# EAGLE design QuadWing 2x2 (EAGLE 9.3.2)
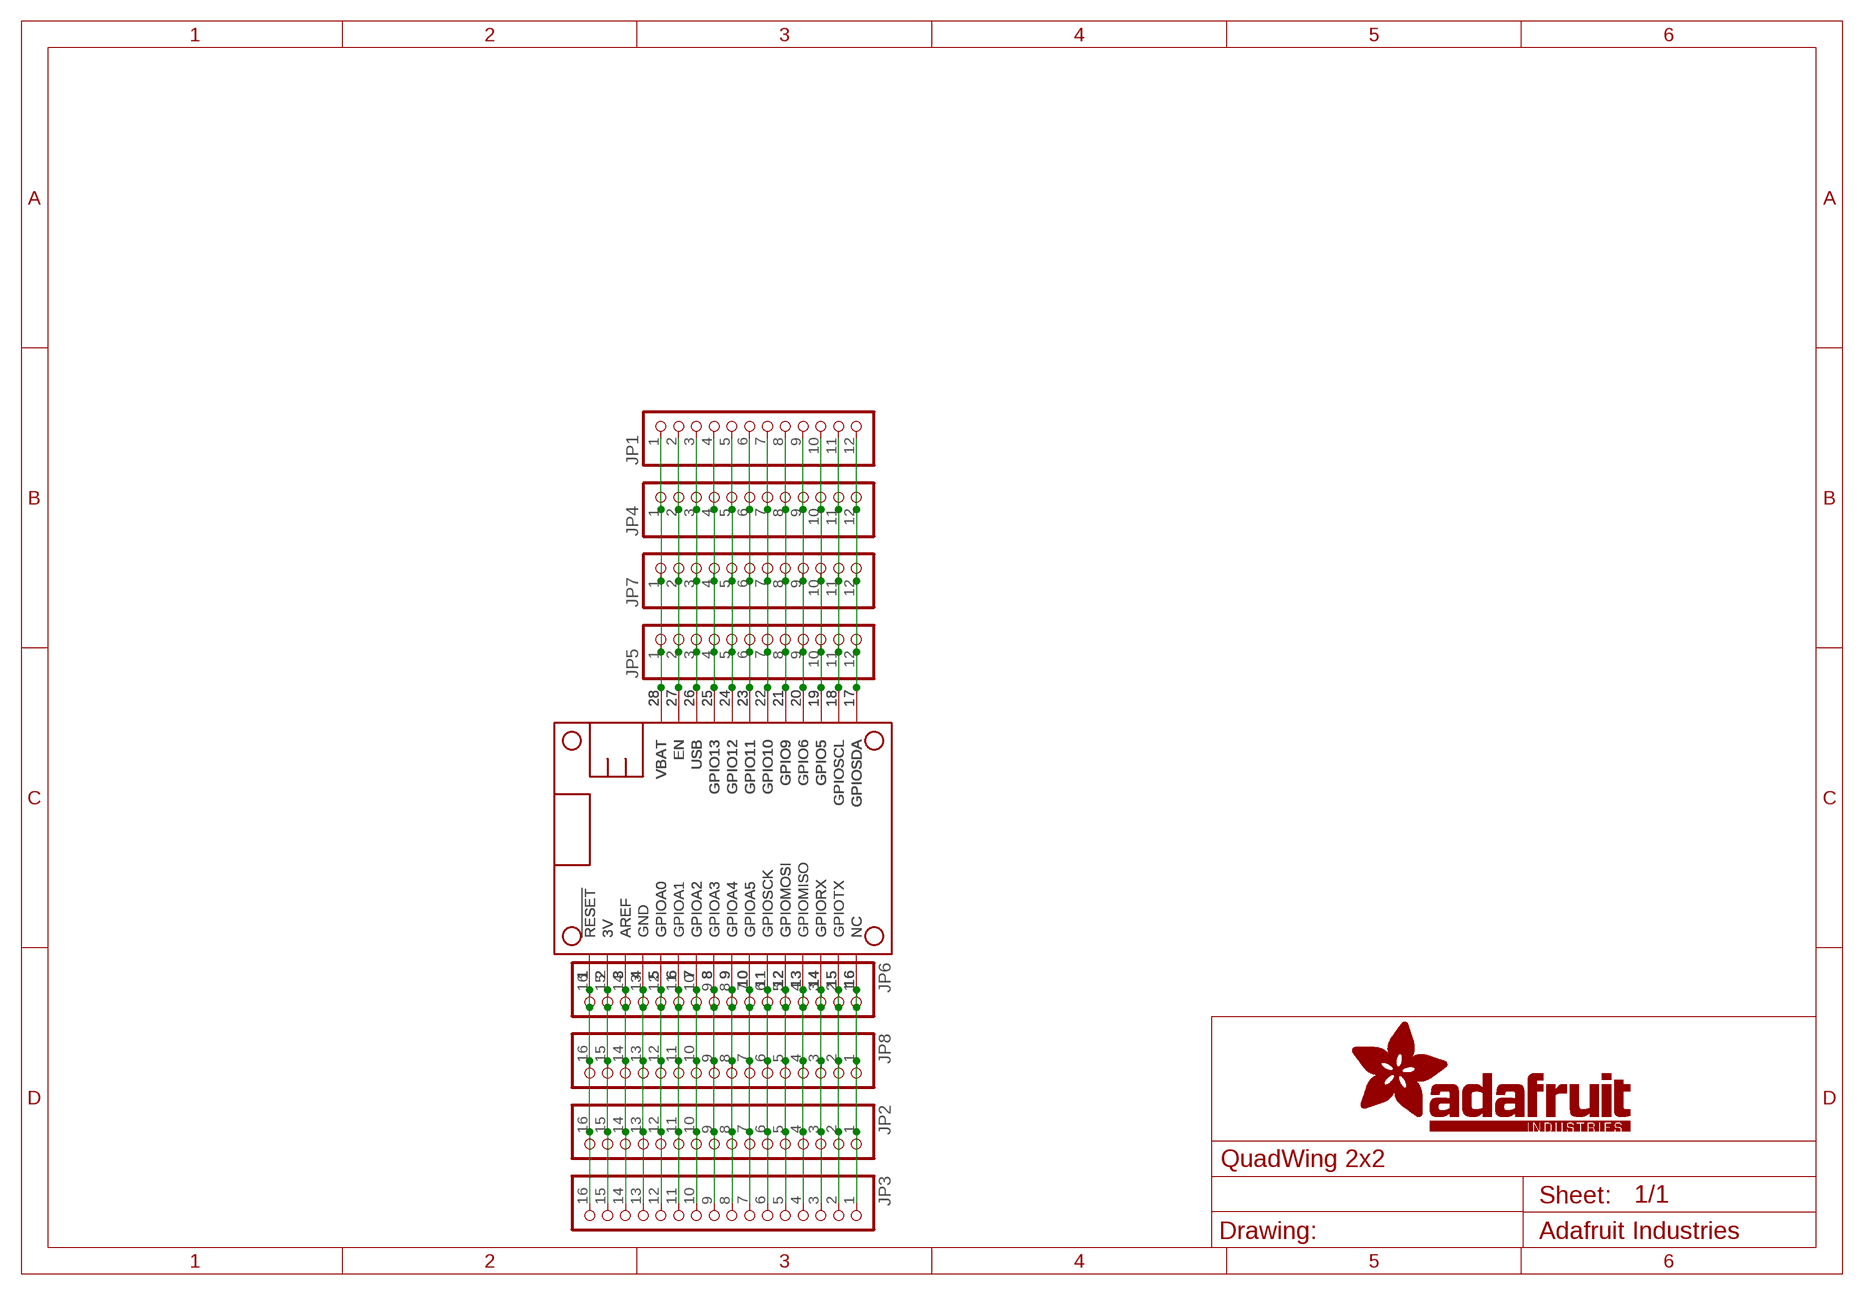
[diagram p0: schematic, sheet 1]

## Parts
JP1  HEADER-1X1276MIL  [1X12_ROUND_76MIL]
JP2  HEADER-1X16_76MIL  [1X16_ROUND_76MIL]
JP3  HEADER-1X16_76MIL  [1X16_ROUND_76MIL]
JP4  HEADER-1X1276MIL  [1X12_ROUND_76MIL]
JP5  HEADER-1X1276MIL  [1X12_ROUND_76MIL]
JP6  HEADER-1X16_76MIL  [1X16_ROUND_76MIL]
JP7  HEADER-1X1276MIL  [1X12_ROUND_76MIL]
JP8  HEADER-1X16_76MIL  [1X16_ROUND_76MIL]
MS1  FEATHERWING_NODIM  [FEATHERWING_DIM]
MS2  FEATHERWING_NODIM  [FEATHERWING_DIM]
MS3  FEATHERWING_NODIM  [FEATHERWING_DIM]
MS4  FEATHERWING_NODIM  [FEATHERWING_DIM]

## Nets
3V: JP2.15 JP3.15 JP6.15 JP8.15 MS1.2(3V) MS2.2(3V) MS3.2(3V) MS4.2(3V)
A: JP2.12 JP3.12 JP6.12 JP8.12 MS1.5(GPIOA0) MS2.5(GPIOA0) MS3.5(GPIOA0) MS4.5(GPIOA0)
AREF: JP2.14 JP3.14 JP6.14 JP8.14 MS1.3(AREF) MS2.3(AREF) MS3.3(AREF) MS4.3(AREF)
B: JP2.11 JP3.11 JP6.11 JP8.11 MS1.6(GPIOA1) MS2.6(GPIOA1) MS3.6(GPIOA1) MS4.6(GPIOA1)
C: JP2.10 JP3.10 JP6.10 JP8.10 MS1.7(GPIOA2) MS2.7(GPIOA2) MS3.7(GPIOA2) MS4.7(GPIOA2)
D: JP2.9 JP3.9 JP6.9 JP8.9 MS1.8(GPIOA3) MS2.8(GPIOA3) MS3.8(GPIOA3) MS4.8(GPIOA3)
E: JP2.8 JP3.8 JP6.8 JP8.8 MS1.9(GPIOA4) MS2.9(GPIOA4) MS3.9(GPIOA4) MS4.9(GPIOA4)
EN: JP1.2 JP4.2 JP5.2 JP7.2 MS1.27(EN) MS2.27(EN) MS3.27(EN) MS4.27(EN)
F: JP2.7 JP3.7 JP6.7 JP8.7 MS1.10(GPIOA5) MS2.10(GPIOA5) MS3.10(GPIOA5) MS4.10(GPIOA5)
G: JP2.1 JP3.1 JP6.1 JP8.1 MS1.16(NC) MS2.16(NC) MS3.16(NC) MS4.16(NC)
GND: JP2.13 JP3.13 JP6.13 JP8.13 MS1.4(GND) MS2.4(GND) MS3.4(GND) MS4.4(GND)
I: JP1.9 JP4.9 JP5.9 JP7.9 MS1.20(GPIO6) MS2.20(GPIO6) MS3.20(GPIO6) MS4.20(GPIO6)
J: JP1.10 JP4.10 JP5.10 JP7.10 MS1.19(GPIO5) MS2.19(GPIO5) MS3.19(GPIO5) MS4.19(GPIO5)
K: JP1.8 JP4.8 JP5.8 JP7.8 MS1.21(GPIO9) MS2.21(GPIO9) MS3.21(GPIO9) MS4.21(GPIO9)
L: JP1.7 JP4.7 JP5.7 JP7.7 MS1.22(GPIO10) MS2.22(GPIO10) MS3.22(GPIO10) MS4.22(GPIO10)
M: JP1.6 JP4.6 JP5.6 JP7.6 MS1.23(GPIO11) MS2.23(GPIO11) MS3.23(GPIO11) MS4.23(GPIO11)
MISO: JP2.4 JP3.4 JP6.4 JP8.4 MS1.13(GPIOMISO) MS2.13(GPIOMISO) MS3.13(GPIOMISO) MS4.13(GPIOMISO)
MOSI: JP2.5 JP3.5 JP6.5 JP8.5 MS1.12(GPIOMOSI) MS2.12(GPIOMOSI) MS3.12(GPIOMOSI) MS4.12(GPIOMOSI)
N: JP1.5 JP4.5 JP5.5 JP7.5 MS1.24(GPIO12) MS2.24(GPIO12) MS3.24(GPIO12) MS4.24(GPIO12)
O: JP1.4 JP4.4 JP5.4 JP7.4 MS1.25(GPIO13) MS2.25(GPIO13) MS3.25(GPIO13) MS4.25(GPIO13)
RESET: JP2.16 JP3.16 JP6.16 JP8.16 MS1.1(!RESET) MS2.1(!RESET) MS3.1(!RESET) MS4.1(!RESET)
RX: JP2.3 JP3.3 JP6.3 JP8.3 MS1.14(GPIORX) MS2.14(GPIORX) MS3.14(GPIORX) MS4.14(GPIORX)
SCK: JP2.6 JP3.6 JP6.6 JP8.6 MS1.11(GPIOSCK) MS2.11(GPIOSCK) MS3.11(GPIOSCK) MS4.11(GPIOSCK)
SCL: JP1.11 JP4.11 JP5.11 JP7.11 MS1.18(GPIOSCL) MS2.18(GPIOSCL) MS3.18(GPIOSCL) MS4.18(GPIOSCL)
SDA: JP1.12 JP4.12 JP5.12 JP7.12 MS1.17(GPIOSDA) MS2.17(GPIOSDA) MS3.17(GPIOSDA) MS4.17(GPIOSDA)
TX: JP2.2 JP3.2 JP6.2 JP8.2 MS1.15(GPIOTX) MS2.15(GPIOTX) MS3.15(GPIOTX) MS4.15(GPIOTX)
USB: JP1.3 JP4.3 JP5.3 JP7.3 MS1.26(USB) MS2.26(USB) MS3.26(USB) MS4.26(USB)
VBAT: JP1.1 JP4.1 JP5.1 JP7.1 MS1.28(VBAT) MS2.28(VBAT) MS3.28(VBAT) MS4.28(VBAT)

## Library data of the parts
JP1 JP4 JP5 JP7 = microbuilder:HEADER-1X12
JP2 JP3 JP6 JP8 = microbuilder:HEADER-1X16: PIN HEADER
MS1-MS4 = microbuilder:FEATHERWING

## Board
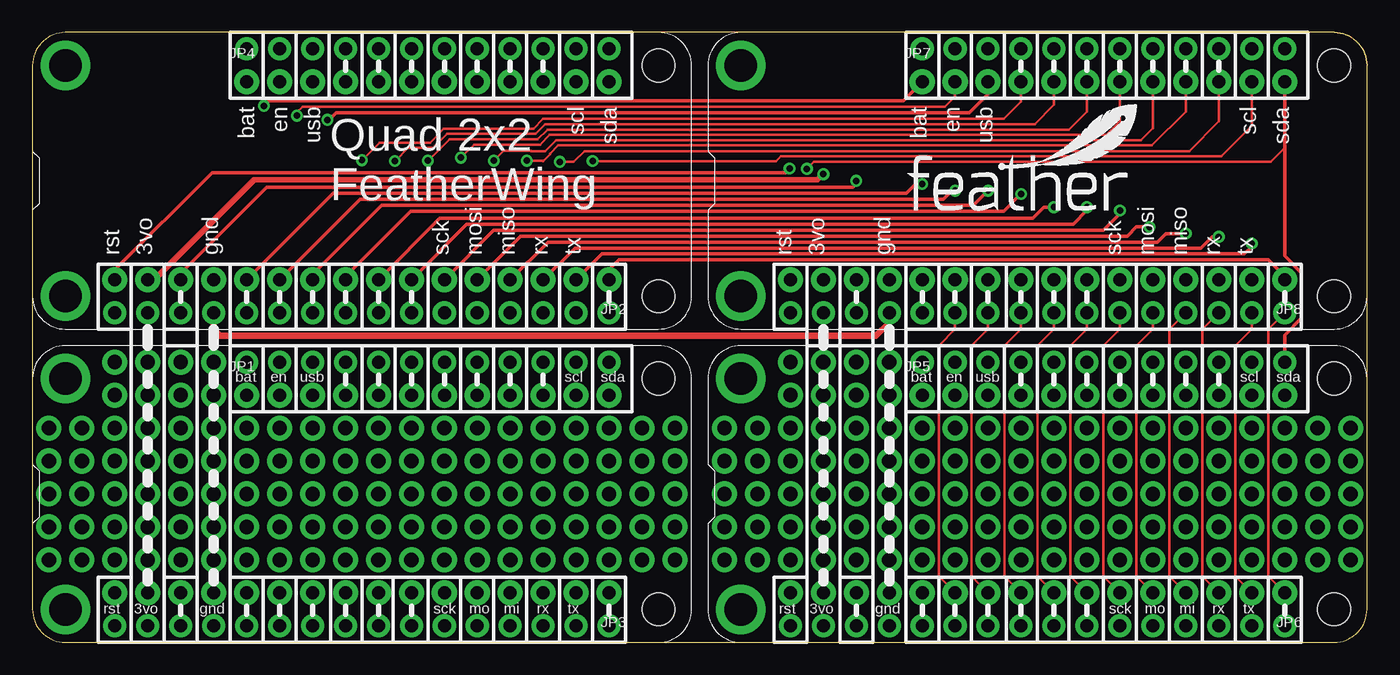
[diagram p1: board, top side]
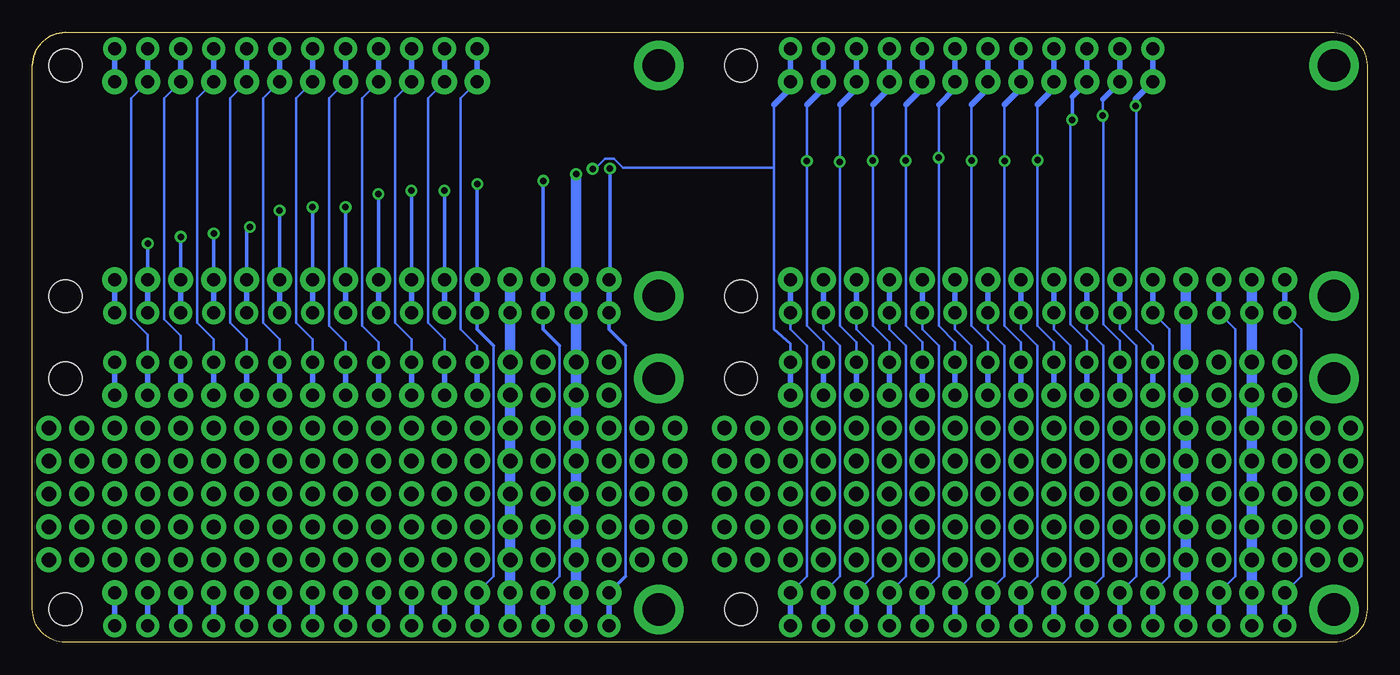
[diagram p2: board, bottom side, seen from below]

Size 102.87 x 46.99 mm. Coordinates in mm from the lower left corner, seen from the top.
Outline: 100.33,46.99 arc-90 102.87,44.45
Outline: 102.87,44.45 102.87,2.54 arc-90 100.33,0 2.54,0 arc-90 0,2.54 0,44.45 arc-90 2.54,46.99 100.33,46.99
Outline: 102.87,44.45 arc90 100.33,46.99
Copper layers (1*16): Top 0.035mm / dielectric 1.5mm / Bottom 0.035mm
Design rules "adafruit": minimum track width 8mil, minimum drill 15.5mil, track to track 8mil, track to pad 8mil, pad to pad 8mil, via to via 8mil, smd to smd 8mil, copper to edge 10mil, drill to drill 8mil, minimum pad ring 10mil, minimum via ring 8mil, stop-mask expansion 2mil, vias tented up to drill 20mil, thermal gap 10mil

### Footprints (pad centres in the part's own frame; a part is rotated, then mirrored left to right if it is on the bottom)
1X12_ROUND_76MIL = drill 1 pad 1.93: 1 -13.97,0; 2 -11.43,0; 3 -8.89,0; 4 -6.35,0; 5 -3.81,0; 6 -1.27,0; 7 1.27,0; 8 3.81,0; 9 6.35,0; 10 8.89,0; 11 11.43,0; 12 13.97,0
1X16_ROUND_76MIL = drill 1 pad 1.93: 1 -19.05,0; 2 -16.51,0; 3 -13.97,0; 4 -11.43,0; 5 -8.89,0; 6 -6.35,0; 7 -3.81,0; 8 -1.27,0; 9 1.27,0; 10 3.81,0; 11 6.35,0; 12 8.89,0; 13 11.43,0; 14 13.97,0; 15 16.51,0; 16 19.05,0
FEATHERWING_DIM = drill 1 pad 1.778: 1 6.35,1.27; 2 8.89,1.27; 3 11.43,1.27; 4 13.97,1.27; 5 16.51,1.27; 6 19.05,1.27; 7 21.59,1.27; 8 24.13,1.27; 9 26.67,1.27; 10 29.21,1.27; 11 31.75,1.27; 12 34.29,1.27; 13 36.83,1.27; 14 39.37,1.27; 15 41.91,1.27; 16 44.45,1.27; 17 44.45,21.59; 18 41.91,21.59; 19 39.37,21.59; 20 36.83,21.59; 21 34.29,21.59; 22 31.75,21.59; 23 29.21,21.59; 24 26.67,21.59; 25 24.13,21.59; 26 21.59,21.59; 27 19.05,21.59; 28 16.51,21.59 | drill 2.5 pad 3.81: P$1 2.54,20.32; P$2 2.54,2.54 | hole 2.54: 48.26,20.32; 48.26,2.54

### Placement (x,y rotation side)
JP1  30.48,19.05 0 top
JP2  25.4,27.94 180 top
JP3  25.4,3.81 180 top
JP4  30.48,43.18 0 top
JP5  82.55,19.05 0 top
JP6  77.47,3.81 180 top
JP7  82.55,43.18 0 top
JP8  77.47,27.94 180 top
MS1  0,0 0 top
MS2  0,24.13 0 top
MS3  52.07,0 0 top
MS4  52.07,24.13 0 top
U$2  [FEATHERLOGO_MED]  67.31,33.21 0 top

### Tracks (layer width: path | path; a pad name or v marks a point on that pad's centre or on a via)
3V  (via drill 0.5, 1.1 pad 1.93)
  Top 0.406: JP2.15 9.4,27.94 17.08,35.62 60.52,35.62 v60.96,36.07
  Bottom 0.813: MS1.2 JP3.15 v8.89,6.35 v8.89,8.89 v8.89,11.43 v8.89,13.97 v8.89,16.51 v8.89,19.05 v8.89,21.59 MS2.2 JP2.15 | MS3.2 JP6.15 v60.96,6.35 v60.96,8.89 v60.96,11.43 v60.96,13.97 v60.96,16.51 v60.96,19.05 v60.96,21.59 MS4.2 JP8.15 v60.96,36.07
A  (via drill 0.5)
  Top 0.254: JP2.12 23.16,34.59 67.36,34.59 68.07,35.31 v68.58,35.31
  Bottom 0.203: JP3.12 15.24,5.08 15.24,24.13 MS2.5 | 67.31,22.86 67.31,5.08 JP6.12
  Bottom 0.254: 67.31,22.86 68.58,24.13 MS4.5 | v68.58,35.31 JP8.12
  Bottom 0.406: JP3.12 MS1.5 | JP2.12 MS2.5 | JP6.12 MS3.5 | JP8.12 MS4.5
AREF  (via drill 0.5)
  Top 0.254: JP2.14 11.43,28.45 18.03,35.05 63.25,35.05 63.5,35.31 v63.5,35.56
  Bottom 0.203: JP3.14 10.16,5.08 10.16,24.13 MS2.3 | 62.23,22.86 62.23,5.08 JP6.14
  Bottom 0.254: 62.23,22.86 63.5,24.13 MS4.3 | v63.5,35.56 JP8.14
  Bottom 0.406: JP3.14 MS1.3 | JP2.14 MS2.3 | JP6.14 MS3.3 | JP8.14 MS4.3
B  (via drill 0.5)
  Top 0.203: MS4.6 71.12,24.13 69.85,22.86 69.85,5.08 JP6.11
  Top 0.254: JP2.11 25.25,34.14 70.21,34.14 70.87,34.8 v71.12,34.8 | JP2.11
  Bottom 0.203: JP3.11 17.78,5.08 17.78,22.86 19.05,24.13 MS2.6
  Bottom 0.254: v71.12,34.8 JP8.11
  Bottom 0.406: MS1.6 JP3.11 | JP2.11 MS2.6 | JP6.11 MS3.6 | JP8.11 MS4.6
C  (via drill 0.5)
  Top 0.203: MS4.7 73.66,24.13 72.39,22.86 72.39,5.08 JP6.10
  Top 0.254: JP2.10 21.59,28.35 26.92,33.68 72.54,33.68 v73.66,34.8
  Bottom 0.203: JP3.10 20.32,5.08 20.32,22.86 21.59,24.13 MS2.7
  Bottom 0.254: v73.66,34.8 JP8.10
  Bottom 0.406: JP3.10 MS1.7 | JP2.10 MS2.7 | JP6.10 MS3.7 | JP8.10 MS4.7
D  (via drill 0.5)
  Top 0.203: MS4.8 76.2,24.13 74.93,22.86 74.93,5.08 JP6.9
  Top 0.254: JP2.9 24.13,28.19 29.16,33.22 74.88,33.22 v76.2,34.54
  Bottom 0.203: JP3.9 22.86,5.08 22.86,22.86 24.13,24.13 MS2.8
  Bottom 0.254: v76.2,34.54 JP8.9
  Bottom 0.406: MS1.8 JP3.9 | JP2.9 MS2.8 | JP6.9 MS3.8 | JP8.9 MS4.8
E  (via drill 0.5)
  Top 0.203: MS4.9 78.74,24.13 77.47,22.86 77.47,5.08 JP6.8
  Top 0.254: JP2.8 31.39,32.66 77.1,32.66 77.96,33.53 v78.74,33.53
  Bottom 0.203: JP3.8 25.4,5.08 25.4,22.86 26.67,24.13 MS2.9
  Bottom 0.254: v78.74,33.53 JP8.8
  Bottom 0.406: JP3.8 MS1.9 | JP2.8 MS2.9 | JP6.8 MS3.9 | JP8.8 MS4.9
EN  (via drill 0.5)
  Top 0.203: JP7.2 71.12,42.04 70.34,41.26 20.82,41.26 20.38,40.83 v20.38,40.58
  Bottom 0.203: MS1.27 19.05,23.24 20.32,24.51 20.32,40.51 v20.38,40.58 20.38,41.85 | MS3.27 71.12,23.37 72.39,24.64 72.39,41.91 JP7.2
  Bottom 0.406: JP1.2 MS1.27 | MS2.27 JP4.2 20.38,41.85 | MS3.27 JP5.2 | MS4.27 JP7.2
F  (via drill 0.5)
  Top 0.203: MS4.10 81.28,24.13 80.01,22.86 80.01,5.08 JP6.7
  Top 0.254: v81.28,33.53 81.28,33.27 80.21,32.21 33.48,32.21 JP2.7
  Bottom 0.203: JP3.7 27.94,5.08 27.94,22.86 29.21,24.13 MS2.10
  Bottom 0.254: v81.28,33.53 JP8.7
  Bottom 0.406: MS1.10 JP3.7 | JP2.7 MS2.10 | JP6.7 MS3.10 | JP8.7 MS4.10
G
  Top 0.203: MS4.16 95.25,24.13 95.25,5.08 JP6.1
  Top 0.254: JP2.1 44.45,28.7 45.21,29.46 95.25,29.46 96.52,28.19 JP8.1
  Bottom 0.203: JP3.1 43.18,5.08 43.18,22.86 44.45,24.13 MS2.16
  Bottom 0.406: JP3.1 MS1.16 | JP2.1 MS2.16 | JP6.1 MS3.16 | JP8.1 MS4.16
GND  (via drill 1.1 pad 1.93)
  Top 0.508: MS2.4 13.97,24.13 14.48,23.62 65.02,23.62 66.04,24.64 MS4.4
  Bottom 0.813: MS1.4 JP3.13 v13.97,6.35 v13.97,8.89 v13.97,11.43 v13.97,13.97 v13.97,16.51 v13.97,19.05 v13.97,21.59 MS2.4 JP2.13 | MS3.4 JP6.13 v66.04,6.35 v66.04,8.89 v66.04,11.43 v66.04,13.97 v66.04,16.51 v66.04,19.05 v66.04,21.59 MS4.4 JP8.13
I  (via drill 0.5)
  Top 0.203: JP7.9 88.9,40.89 86.3,38.29 40.52,38.29 39.88,37.65 39.88,37.6 39.37,37.08 39.35,37.1 v38.1,37.1
  Bottom 0.203: MS1.20 36.83,23.11 38.1,24.38 v38.1,37.1 38.1,41.4 | MS3.20 88.9,23.37 90.17,24.64 90.17,41.91 JP7.9
  Bottom 0.406: MS1.20 JP1.9 | MS2.20 JP4.9 36.83,42.67 38.1,41.4 | MS3.20 JP5.9 | MS4.20 JP7.9
J  (via drill 0.5)
  Top 0.203: v40.64,37.02 41.72,37.02 42.55,37.85 89.16,37.85 91.44,40.13 JP7.10
  Bottom 0.203: 39.37,21.08 MS1.19 39.37,23.11 40.64,24.38 v40.64,37.02 40.64,41.4 | MS3.19 91.44,23.62 92.71,24.89 92.71,41.91 JP7.10
  Bottom 0.406: JP1.10 39.37,21.08 | MS2.19 JP4.10 39.37,42.67 40.64,41.4 | MS3.19 JP5.10 | MS4.19 JP7.10
K  (via drill 0.5)
  Top 0.203: JP7.8 86.36,39.62 85.43,38.7 40.35,38.7 39.5,37.85 38.43,37.85 38.41,37.86 36.32,37.86 v35.56,37.1
  Bottom 0.203: MS1.21 34.29,23.11 35.56,24.38 v35.56,37.1 35.56,41.4 | MS3.21 86.36,23.37 87.63,24.64 87.63,41.91 JP7.8
  Bottom 0.406: JP1.8 MS1.21 | MS2.21 JP4.8 34.29,42.67 35.56,41.4 | MS3.21 JP5.8 | MS4.21 JP7.8
L  (via drill 0.5)
  Top 0.203: JP7.7 83.82,40.13 82.79,39.1 39.87,39.1 39.12,38.35 34.04,38.35 v33.02,37.34
  Bottom 0.203: MS1.22 31.75,23.11 33.02,24.38 v33.02,37.34 33.02,41.4 | MS3.22 83.82,23.37 85.09,24.64 85.09,41.91 JP7.7
  Bottom 0.406: MS1.22 JP1.7 | MS2.22 JP4.7 31.75,42.67 33.02,41.4 | MS3.22 JP5.7 | MS4.22 JP7.7
M  (via drill 0.5)
  Top 0.203: JP7.6 81.28,40.89 79.9,39.51 39.7,39.51 38.95,38.76 32.13,38.76 v30.48,37.1
  Bottom 0.203: MS1.23 29.21,23.11 30.48,24.38 v30.48,37.1 30.48,41.4 | MS3.23 81.28,23.37 82.55,24.64 82.55,41.91 JP7.6
  Bottom 0.406: JP1.6 MS1.23 | MS2.23 JP4.6 29.21,42.67 30.48,41.4 | MS3.23 JP5.6 | MS4.23 JP7.6
MISO  (via drill 0.5)
  Top 0.203: MS4.13 87.63,24.13 87.63,5.08 JP6.4
  Top 0.254: JP2.4 39.73,30.84 86.72,30.84 87.38,31.5 v88.9,31.5
  Bottom 0.203: JP3.4 35.56,5.08 35.56,22.86 36.83,24.13 MS2.13
  Bottom 0.254: v88.9,31.5 JP8.4
  Bottom 0.406: JP3.4 MS1.13 | JP2.4 MS2.13 | JP6.4 MS3.13 | JP8.4 MS4.13
MOSI  (via drill 0.5)
  Top 0.203: MS4.12 86.36,24.13 85.09,22.86 85.09,5.08 JP6.5
  Top 0.254: v86.11,32 85.09,32 84.38,31.29 37.64,31.29 JP2.5
  Bottom 0.203: JP3.5 33.02,5.08 33.02,22.86 34.29,24.13 MS2.12
  Bottom 0.254: v86.11,32 86.36,31.75 JP8.5
  Bottom 0.406: MS1.12 JP3.5 | JP2.5 MS2.12 | JP6.5 MS3.12 | JP8.5 MS4.12
N  (via drill 0.5)
  Top 0.203: JP7.5 78.74,41.4 77.25,39.92 39.53,39.92 38.78,39.17 31.97,39.17 30.9,38.1 28.96,38.1 v27.94,37.08
  Bottom 0.203: MS1.24 26.67,23.11 27.94,24.38 v27.94,37.08 27.94,41.4 | MS3.24 78.74,23.11 80.01,24.38 80.01,41.91 JP7.5
  Bottom 0.406: MS1.24 JP1.5 | MS2.24 JP4.5 26.67,42.67 27.94,41.4 | MS3.24 JP5.5 | MS4.24 JP7.5
N$1  (via drill 1.1 pad 1.93)
  other vias: 96.52,6.35
N$2  (via drill 1.1 pad 1.93)
  other vias: 96.52,8.89
N$3  (via drill 1.1 pad 1.93)
  other vias: 96.52,11.43
N$4  (via drill 1.1 pad 1.93)
  other vias: 96.52,13.97
N$5  (via drill 1.1 pad 1.93)
  other vias: 96.52,16.51
N$6  (via drill 1.1 pad 1.93)
  other vias: 93.98,16.51
N$7  (via drill 1.1 pad 1.93)
  other vias: 93.98,13.97
N$8  (via drill 1.1 pad 1.93)
  other vias: 93.98,11.43
N$9  (via drill 1.1 pad 1.93)
  other vias: 93.98,8.89
N$10  (via drill 1.1 pad 1.93)
  other vias: 93.98,6.35
N$11  (via drill 1.1 pad 1.93)
  other vias: 99.06,6.35
N$12  (via drill 1.1 pad 1.93)
  other vias: 99.06,8.89
N$13  (via drill 1.1 pad 1.93)
  other vias: 99.06,11.43
N$14  (via drill 1.1 pad 1.93)
  other vias: 99.06,13.97
N$15  (via drill 1.1 pad 1.93)
  other vias: 99.06,16.51
N$17  (via drill 1.1 pad 1.93)
  other vias: 101.6,16.51
N$18  (via drill 1.1 pad 1.93)
  other vias: 101.6,13.97
N$19  (via drill 1.1 pad 1.93)
  other vias: 101.6,11.43
N$20  (via drill 1.1 pad 1.93)
  other vias: 101.6,8.89
N$21  (via drill 1.1 pad 1.93)
  other vias: 101.6,6.35
N$22  (via drill 1.1 pad 1.93)
  other vias: 91.44,6.35
N$23  (via drill 1.1 pad 1.93)
  other vias: 91.44,8.89
N$24  (via drill 1.1 pad 1.93)
  other vias: 91.44,11.43
N$25  (via drill 1.1 pad 1.93)
  other vias: 91.44,13.97
N$26  (via drill 1.1 pad 1.93)
  other vias: 6.35,6.35
N$28  (via drill 1.1 pad 1.93)
  other vias: 11.43,6.35
N$31  (via drill 1.1 pad 1.93)
  other vias: 11.43,8.89
N$33  (via drill 1.1 pad 1.93)
  other vias: 6.35,8.89
N$34  (via drill 1.1 pad 1.93)
  other vias: 6.35,11.43
N$36  (via drill 1.1 pad 1.93)
  other vias: 3.81,6.35
N$37  (via drill 1.1 pad 1.93)
  other vias: 1.27,6.35
N$38  (via drill 1.1 pad 1.93)
  other vias: 1.27,8.89
N$39  (via drill 1.1 pad 1.93)
  other vias: 3.81,8.89
N$40  (via drill 1.1 pad 1.93)
  other vias: 3.81,11.43
N$41  (via drill 1.1 pad 1.93)
  other vias: 1.27,11.43
N$42  (via drill 1.1 pad 1.93)
  other vias: 1.27,13.97
N$43  (via drill 1.1 pad 1.93)
  other vias: 3.81,13.97
N$44  (via drill 1.1 pad 1.93)
  other vias: 6.35,13.97
N$46  (via drill 1.1 pad 1.93)
  other vias: 11.43,13.97
N$47  (via drill 1.1 pad 1.93)
  other vias: 11.43,11.43
N$50  (via drill 1.1 pad 1.93)
  other vias: 1.27,16.51
N$51  (via drill 1.1 pad 1.93)
  other vias: 3.81,16.51
N$52  (via drill 1.1 pad 1.93)
  other vias: 6.35,16.51
N$54  (via drill 1.1 pad 1.93)
  other vias: 11.43,16.51
N$58  (via drill 1.1 pad 1.93)
  other vias: 11.43,21.59
N$59  (via drill 1.1 pad 1.93)
  other vias: 11.43,19.05
N$62  (via drill 1.1 pad 1.93)
  other vias: 6.35,21.59
N$63  (via drill 1.1 pad 1.93)
  other vias: 6.35,19.05
N$64  (via drill 1.1 pad 1.93)
  other vias: 16.51,6.35
N$65  (via drill 1.1 pad 1.93)
  other vias: 16.51,8.89
N$66  (via drill 1.1 pad 1.93)
  other vias: 16.51,11.43
N$67  (via drill 1.1 pad 1.93)
  other vias: 16.51,13.97
N$68  (via drill 1.1 pad 1.93)
  other vias: 16.51,16.51
N$69  (via drill 1.1 pad 1.93)
  other vias: 19.05,16.51
N$70  (via drill 1.1 pad 1.93)
  other vias: 19.05,13.97
N$71  (via drill 1.1 pad 1.93)
  other vias: 19.05,11.43
N$72  (via drill 1.1 pad 1.93)
  other vias: 19.05,8.89
N$73  (via drill 1.1 pad 1.93)
  other vias: 19.05,6.35
N$74  (via drill 1.1 pad 1.93)
  other vias: 21.59,6.35
N$75  (via drill 1.1 pad 1.93)
  other vias: 21.59,8.89
N$76  (via drill 1.1 pad 1.93)
  other vias: 21.59,11.43
N$77  (via drill 1.1 pad 1.93)
  other vias: 21.59,13.97
N$78  (via drill 1.1 pad 1.93)
  other vias: 21.59,16.51
N$79  (via drill 1.1 pad 1.93)
  other vias: 24.13,16.51
N$80  (via drill 1.1 pad 1.93)
  other vias: 24.13,13.97
N$81  (via drill 1.1 pad 1.93)
  other vias: 24.13,11.43
N$82  (via drill 1.1 pad 1.93)
  other vias: 24.13,8.89
N$83  (via drill 1.1 pad 1.93)
  other vias: 24.13,6.35
N$84  (via drill 1.1 pad 1.93)
  other vias: 26.67,6.35
N$85  (via drill 1.1 pad 1.93)
  other vias: 26.67,8.89
N$86  (via drill 1.1 pad 1.93)
  other vias: 26.67,11.43
N$87  (via drill 1.1 pad 1.93)
  other vias: 26.67,13.97
N$88  (via drill 1.1 pad 1.93)
  other vias: 26.67,16.51
N$89  (via drill 1.1 pad 1.93)
  other vias: 29.21,16.51
N$90  (via drill 1.1 pad 1.93)
  other vias: 29.21,13.97
N$91  (via drill 1.1 pad 1.93)
  other vias: 29.21,11.43
N$92  (via drill 1.1 pad 1.93)
  other vias: 29.21,8.89
N$93  (via drill 1.1 pad 1.93)
  other vias: 29.21,6.35
N$94  (via drill 1.1 pad 1.93)
  other vias: 31.75,6.35
N$95  (via drill 1.1 pad 1.93)
  other vias: 34.29,6.35
N$96  (via drill 1.1 pad 1.93)
  other vias: 36.83,6.35
N$97  (via drill 1.1 pad 1.93)
  other vias: 39.37,6.35
N$98  (via drill 1.1 pad 1.93)
  other vias: 41.91,6.35
N$99  (via drill 1.1 pad 1.93)
  other vias: 41.91,8.89
N$100  (via drill 1.1 pad 1.93)
  other vias: 41.91,11.43
N$101  (via drill 1.1 pad 1.93)
  other vias: 41.91,13.97
N$102  (via drill 1.1 pad 1.93)
  other vias: 41.91,16.51
N$103  (via drill 1.1 pad 1.93)
  other vias: 39.37,16.51
N$104  (via drill 1.1 pad 1.93)
  other vias: 39.37,13.97
N$105  (via drill 1.1 pad 1.93)
  other vias: 39.37,11.43
N$106  (via drill 1.1 pad 1.93)
  other vias: 39.37,8.89
N$107  (via drill 1.1 pad 1.93)
  other vias: 36.83,8.89
N$108  (via drill 1.1 pad 1.93)
  other vias: 36.83,11.43
N$109  (via drill 1.1 pad 1.93)
  other vias: 36.83,13.97
N$110  (via drill 1.1 pad 1.93)
  other vias: 36.83,16.51
N$111  (via drill 1.1 pad 1.93)
  other vias: 34.29,16.51
N$112  (via drill 1.1 pad 1.93)
  other vias: 34.29,13.97
N$113  (via drill 1.1 pad 1.93)
  other vias: 34.29,11.43
N$114  (via drill 1.1 pad 1.93)
  other vias: 34.29,8.89
N$115  (via drill 1.1 pad 1.93)
  other vias: 31.75,8.89
N$116  (via drill 1.1 pad 1.93)
  other vias: 31.75,11.43
N$117  (via drill 1.1 pad 1.93)
  other vias: 31.75,13.97
N$118  (via drill 1.1 pad 1.93)
  other vias: 31.75,16.51
N$119  (via drill 1.1 pad 1.93)
  other vias: 44.45,16.51
N$120  (via drill 1.1 pad 1.93)
  other vias: 44.45,13.97
N$121  (via drill 1.1 pad 1.93)
  other vias: 44.45,11.43
N$122  (via drill 1.1 pad 1.93)
  other vias: 44.45,8.89
N$123  (via drill 1.1 pad 1.93)
  other vias: 44.45,6.35
N$124  (via drill 1.1 pad 1.93)
  other vias: 46.99,6.35
N$125  (via drill 1.1 pad 1.93)
  other vias: 49.53,6.35
N$126  (via drill 1.1 pad 1.93)
  other vias: 49.53,8.89
N$127  (via drill 1.1 pad 1.93)
  other vias: 46.99,8.89
N$128  (via drill 1.1 pad 1.93)
  other vias: 46.99,11.43
N$129  (via drill 1.1 pad 1.93)
  other vias: 49.53,11.43
N$130  (via drill 1.1 pad 1.93)
  other vias: 49.53,13.97
N$131  (via drill 1.1 pad 1.93)
  other vias: 46.99,13.97
N$132  (via drill 1.1 pad 1.93)
  other vias: 46.99,16.51
N$133  (via drill 1.1 pad 1.93)
  other vias: 49.53,16.51
N$213  (via drill 1.1 pad 1.93)
  other vias: 91.44,16.51
N$214  (via drill 1.1 pad 1.93)
  other vias: 88.9,16.51
N$215  (via drill 1.1 pad 1.93)
  other vias: 88.9,13.97
N$216  (via drill 1.1 pad 1.93)
  other vias: 88.9,11.43
N$217  (via drill 1.1 pad 1.93)
  other vias: 88.9,8.89
N$218  (via drill 1.1 pad 1.93)
  other vias: 88.9,6.35
N$219  (via drill 1.1 pad 1.93)
  other vias: 86.36,6.35
N$220  (via drill 1.1 pad 1.93)
  other vias: 86.36,8.89
N$221  (via drill 1.1 pad 1.93)
  other vias: 86.36,11.43
N$222  (via drill 1.1 pad 1.93)
  other vias: 86.36,13.97
N$223  (via drill 1.1 pad 1.93)
  other vias: 86.36,16.51
N$224  (via drill 1.1 pad 1.93)
  other vias: 83.82,16.51
N$225  (via drill 1.1 pad 1.93)
  other vias: 83.82,13.97
N$226  (via drill 1.1 pad 1.93)
  other vias: 83.82,11.43
N$227  (via drill 1.1 pad 1.93)
  other vias: 83.82,8.89
N$228  (via drill 1.1 pad 1.93)
  other vias: 83.82,6.35
N$229  (via drill 1.1 pad 1.93)
  other vias: 81.28,6.35
N$230  (via drill 1.1 pad 1.93)
  other vias: 81.28,8.89
N$231  (via drill 1.1 pad 1.93)
  other vias: 81.28,11.43
N$232  (via drill 1.1 pad 1.93)
  other vias: 81.28,13.97
N$233  (via drill 1.1 pad 1.93)
  other vias: 81.28,16.51
N$234  (via drill 1.1 pad 1.93)
  other vias: 78.74,16.51
N$235  (via drill 1.1 pad 1.93)
  other vias: 78.74,13.97
N$236  (via drill 1.1 pad 1.93)
  other vias: 78.74,11.43
N$237  (via drill 1.1 pad 1.93)
  other vias: 78.74,8.89
N$238  (via drill 1.1 pad 1.93)
  other vias: 78.74,6.35
N$239  (via drill 1.1 pad 1.93)
  other vias: 76.2,6.35
N$240  (via drill 1.1 pad 1.93)
  other vias: 76.2,8.89
N$241  (via drill 1.1 pad 1.93)
  other vias: 76.2,11.43
N$242  (via drill 1.1 pad 1.93)
  other vias: 76.2,13.97
N$243  (via drill 1.1 pad 1.93)
  other vias: 76.2,16.51
N$244  (via drill 1.1 pad 1.93)
  other vias: 73.66,16.51
N$245  (via drill 1.1 pad 1.93)
  other vias: 73.66,13.97
N$246  (via drill 1.1 pad 1.93)
  other vias: 73.66,11.43
N$247  (via drill 1.1 pad 1.93)
  other vias: 73.66,8.89
N$248  (via drill 1.1 pad 1.93)
  other vias: 73.66,6.35
N$249  (via drill 1.1 pad 1.93)
  other vias: 71.12,6.35
N$250  (via drill 1.1 pad 1.93)
  other vias: 71.12,8.89
N$251  (via drill 1.1 pad 1.93)
  other vias: 71.12,11.43
N$252  (via drill 1.1 pad 1.93)
  other vias: 71.12,13.97
N$253  (via drill 1.1 pad 1.93)
  other vias: 71.12,16.51
N$254  (via drill 1.1 pad 1.93)
  other vias: 68.58,16.51
N$255  (via drill 1.1 pad 1.93)
  other vias: 68.58,13.97
N$256  (via drill 1.1 pad 1.93)
  other vias: 68.58,11.43
N$257  (via drill 1.1 pad 1.93)
  other vias: 68.58,8.89
N$258  (via drill 1.1 pad 1.93)
  other vias: 68.58,6.35
N$259  (via drill 1.1 pad 1.93)
  other vias: 63.5,6.35
N$260  (via drill 1.1 pad 1.93)
  other vias: 63.5,8.89
N$261  (via drill 1.1 pad 1.93)
  other vias: 63.5,11.43
N$262  (via drill 1.1 pad 1.93)
  other vias: 63.5,13.97
N$263  (via drill 1.1 pad 1.93)
  other vias: 63.5,16.51
N$264  (via drill 1.1 pad 1.93)
  other vias: 63.5,19.05
N$265  (via drill 1.1 pad 1.93)
  other vias: 63.5,21.59
N$266  (via drill 1.1 pad 1.93)
  other vias: 58.42,6.35
N$267  (via drill 1.1 pad 1.93)
  other vias: 58.42,8.89
N$268  (via drill 1.1 pad 1.93)
  other vias: 58.42,11.43
N$269  (via drill 1.1 pad 1.93)
  other vias: 58.42,13.97
N$270  (via drill 1.1 pad 1.93)
  other vias: 58.42,16.51
N$271  (via drill 1.1 pad 1.93)
  other vias: 58.42,19.05
N$272  (via drill 1.1 pad 1.93)
  other vias: 58.42,21.59
N$273  (via drill 1.1 pad 1.93)
  other vias: 55.88,16.51
N$274  (via drill 1.1 pad 1.93)
  other vias: 53.34,16.51
N$275  (via drill 1.1 pad 1.93)
  other vias: 53.34,13.97
N$276  (via drill 1.1 pad 1.93)
  other vias: 55.88,13.97
N$277  (via drill 1.1 pad 1.93)
  other vias: 55.88,11.43
N$278  (via drill 1.1 pad 1.93)
  other vias: 53.34,11.43
N$279  (via drill 1.1 pad 1.93)
  other vias: 53.34,8.89
N$280  (via drill 1.1 pad 1.93)
  other vias: 55.88,8.89
N$281  (via drill 1.1 pad 1.93)
  other vias: 55.88,6.35
N$282  (via drill 1.1 pad 1.93)
  other vias: 53.34,6.35
O  (via drill 0.5)
  Top 0.203: JP7.4 76.2,41.66 74.87,40.32 39.36,40.32 38.61,39.57 31.7,39.57 30.63,38.51 26.76,38.51 v25.4,37.15
  Bottom 0.203: MS1.25 24.13,23.11 25.4,24.38 v25.4,37.15 25.4,41.4 | MS3.25 76.2,23.11 77.47,24.38 77.47,41.91 JP7.4
  Bottom 0.406: JP1.4 MS1.25 | MS2.25 JP4.4 24.13,42.67 25.4,41.4 | MS3.25 JP5.4 | MS4.25 JP7.4
RESET  (via drill 0.5)
  Top 0.254: JP2.16 6.35,28.7 13.84,36.2 58.04,36.2 v58.36,36.51
  Bottom 0.203: JP3.16 5.08,5.08 5.08,24.13 MS2.1 | 57.15,22.86 57.15,5.08
  Bottom 0.254: 57.15,22.86 58.42,24.13 MS4.1 | JP6.16 57.15,5.08 | v58.36,36.51 58.36,28 JP8.16
  Bottom 0.406: MS1.1 JP3.16 | JP2.16 MS2.1 | JP6.16 MS3.1 | JP8.16 MS4.1
RX  (via drill 0.5)
  Top 0.203: MS4.14 90.17,24.13 90.17,5.08 JP6.3
  Top 0.254: JP2.3 41.81,30.38 90.07,30.38 90.93,31.24 v91.44,31.24
  Bottom 0.203: JP3.3 38.1,5.08 38.1,22.86 39.37,24.13 MS2.14
  Bottom 0.254: v91.44,31.24 JP8.3
  Bottom 0.406: JP3.3 MS1.14 | JP2.3 MS2.14 | JP6.3 MS3.14 | JP8.3 MS4.14
SCK  (via drill 0.5)
  Top 0.203: MS4.11 83.82,24.13 82.55,22.86 82.55,5.08 JP6.6
  Top 0.254: JP2.6 35.56,31.75 82.55,31.75 83.82,33.02 v83.82,33.27
  Bottom 0.203: JP3.6 30.48,5.08 30.48,22.86 31.75,24.13 MS2.11
  Bottom 0.254: v83.82,33.27 JP8.6
  Bottom 0.406: JP3.6 MS1.11 | JP2.6 MS2.11 | JP6.6 MS3.11 | JP8.6 MS4.11
SCL  (via drill 0.5)
  Top 0.203: v43.18,37.08 57.33,37.08 57.69,37.45 91.63,37.45 93.98,39.8 JP7.11
  Bottom 0.203: MS1.18 41.91,23.11 43.18,24.38 v43.18,37.08 43.18,41.4 | MS3.18 93.98,23.71 95.25,24.98 95.25,41.91 JP7.11
  Bottom 0.406: MS1.18 JP1.11 | MS2.18 JP4.11 41.91,42.67 43.18,41.4 | MS3.18 JP5.11 | MS4.18 JP7.11
SDA  (via drill 0.5)
  Top 0.203: 96.52,38.1 95.46,37.04 61.53,37.02 60.23,37.02 v59.69,36.48
  Top 0.254: MS3.17 96.52,23.68 97.81,24.97 97.81,28.48 96.52,29.77 96.52,38.1 JP7.12
  Bottom 0.203: MS1.17 44.45,22.99 45.72,24.13 45.72,36.58 | 45.72,41.4 45.72,36.58 | 45.72,36.58 57.35,36.58 58.04,37.27 58.74,37.27 59.63,36.39 59.69,36.45 v59.69,36.48
  Bottom 0.406: MS1.17 JP1.12 | MS2.17 JP4.12 44.45,42.67 45.72,41.4 | MS3.17 JP5.12 | MS4.17 JP7.12
TX  (via drill 0.5)
  Top 0.203: MS4.15 93.98,24.13 92.71,22.86 92.71,5.08 JP6.2
  Top 0.254: JP2.2 43.89,29.92 93.42,29.92 93.98,30.48 v93.98,30.73
  Bottom 0.203: JP3.2 40.64,5.08 40.64,22.86 41.91,24.13 MS2.15
  Bottom 0.254: v93.98,30.73 JP8.2
  Bottom 0.406: MS1.15 JP3.2 | JP2.2 MS2.15 | JP6.2 MS3.15 | JP8.2 MS4.15
USB  (via drill 0.5)
  Top 0.254: JP7.3 73.66,42.23 72.22,40.79 23.39,40.79 22.86,40.26 v22.73,40.26
  Bottom 0.203: MS1.26 21.59,23.24 22.86,24.51 22.86,40.13 v22.73,40.26 | MS3.26 73.66,23.37 74.93,24.64 74.93,41.91 JP7.3
  Bottom 0.254: 22.73,42.04 v22.73,40.26
  Bottom 0.406: MS1.26 JP1.3 | MS2.26 JP4.3 22.73,42.04 | MS3.26 JP5.3 | MS4.26 JP7.3
VBAT  (via drill 0.5)
  Top 0.254: JP7.1 67.13,41.73 18.24,41.73 v17.84,41.34
  Bottom 0.203: MS1.28 16.51,22.86 17.78,24.13 17.78,41.27 v17.84,41.34 | MS3.28 68.58,22.86 69.85,24.13 69.85,41.91 JP7.1
  Bottom 0.254: 17.84,41.85 v17.84,41.34
  Bottom 0.406: MS1.28 JP1.1 | MS2.28 JP4.1 17.84,41.85 | MS3.28 JP5.1 | MS4.28 JP7.1

### Text on the board
tPlace: bat | en | usb | scl | sda | bat | en | usb | scl | sda | Quad 2x2 / FeatherWing | rst | 3vo | gnd | sck | mosi | miso | rx | tx | rst | 3vo | gnd | sck | mosi | miso | rx | tx | bat | en | usb | scl | sda | bat | en | usb | scl | sda | rst | 3vo | gnd | sck | mo | mi | rx | tx | rst | 3vo | gnd | sck | mo | mi | rx | tx